# EasyEDA Pro project ProPrj_OpenTCUV4_2026-04-02.epro

# Schematic OpenTCUSandwich
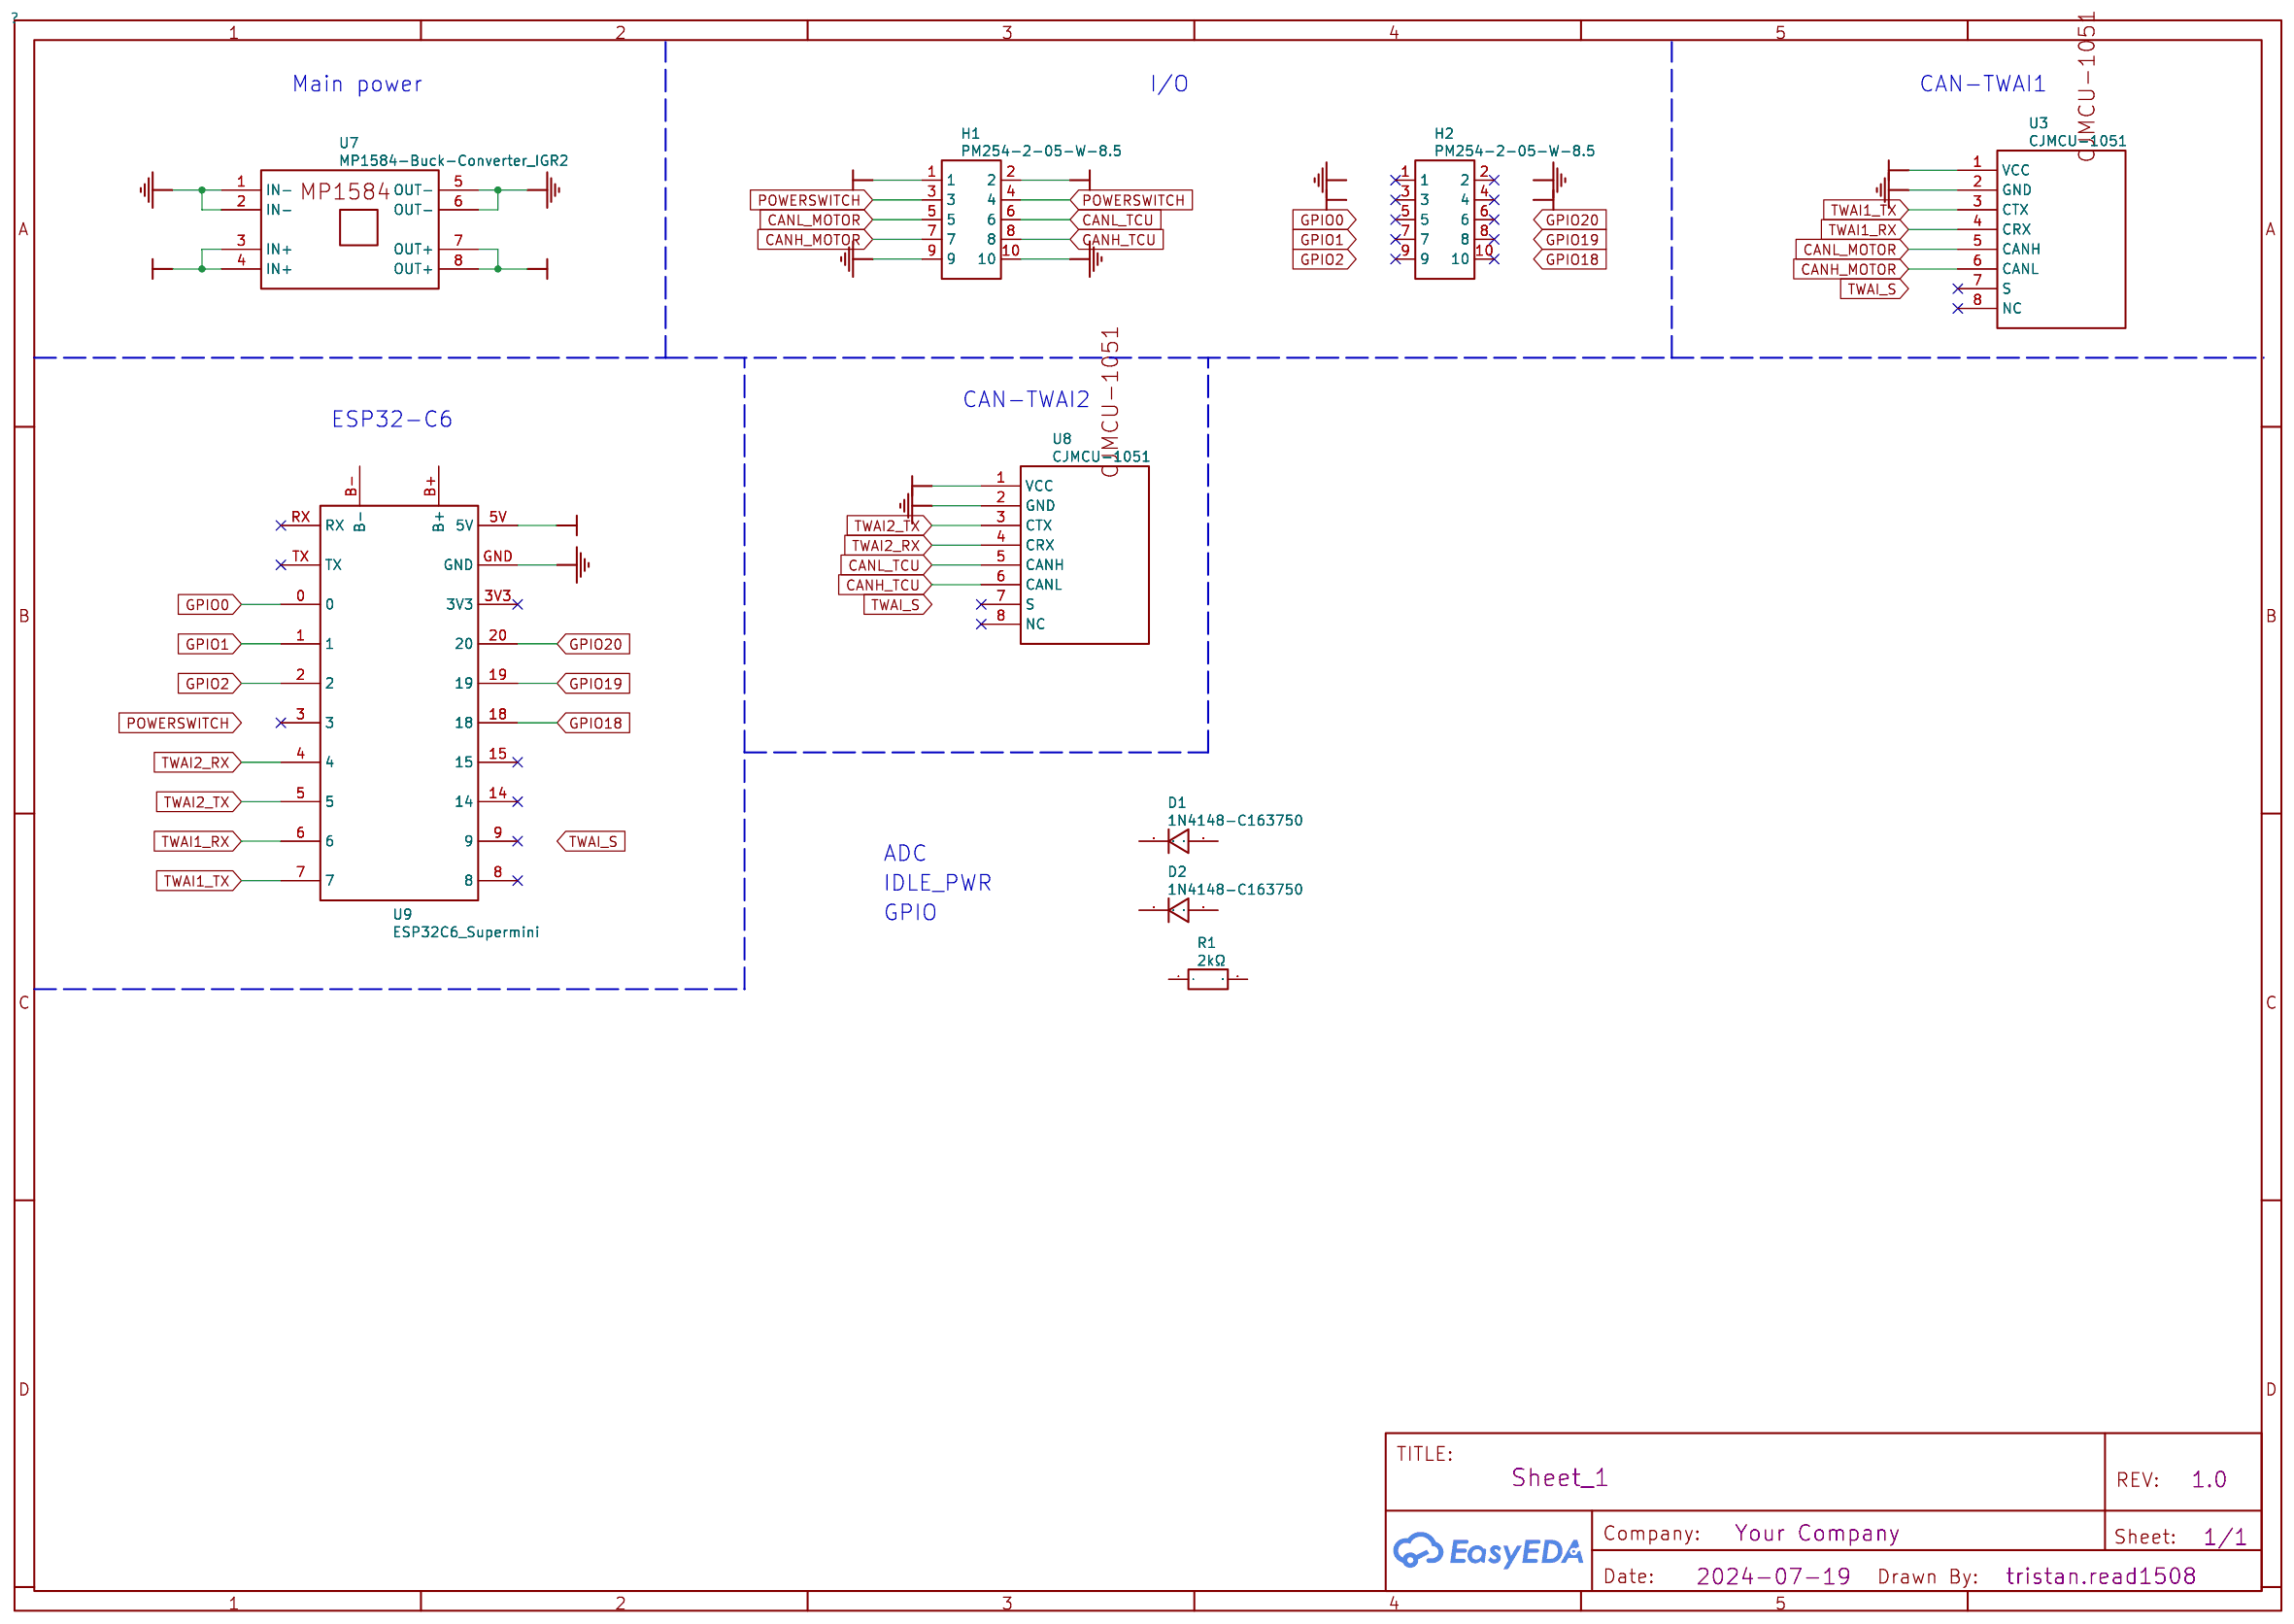
[diagram p0: schematic sheet]

## Parts
D1  1N4148-C163750  [DO-35_BD2.0-L4.2-P8.20-D0.5-RD]
D2  1N4148-C163750  [DO-35_BD2.0-L4.2-P8.20-D0.5-RD]
H1  PM254-2-05-W-8.5  [HDR-TH_10P-P2.54-H-F-R2-C5-W8.5]
H2  PM254-2-05-W-8.5  [HDR-TH_10P-P2.54-H-F-R2-C5-W8.5]
R1  2kΩ  [RES-TH_BD2.4-L6.3-P10.30-D0.6]
U3  CJMCU-1051  [CJMCU-1051]
U7  MP1584-Buck-Converter_IGR2  [MP1584EN-BUCK-CONVERTER]
U8  CJMCU-1051  [CJMCU-1051]
U9  ESP32C6_Supermini  [ESP32-C6-SUPERMINI]

## Library data of the parts
D1 D2 = 1N4148-C163750: Supplier Part: C163750; Supplier: LCSC; Manufacturer: FMS(美丽微); Manufacturer Part: 1N4148; JLCPCB Part Class: Extended Part; Contributor: LCSC; spicePre: D
H1 = PM254-2-05-W-8.5: Supplier: LCSC; Supplier Part: C2897425; Manufacturer: HCTL(华灿天禄); JLCPCB Part Class: Extended Part; Contributor: LCSC; spicePre: H
H2 = PM254-2-05-W-8.5: Supplier: LCSC; Supplier Part: C2897425; Manufacturer: HCTL(华灿天禄); JLCPCB Part Class: Extended Part; link: https://lcsc.com/eda_search?q=C2897425&%26type=1&ref=editor; Contributor: LCSC; spicePre: H
R1 = 2kΩ: Supplier: LCSC; Supplier Part: C410663; Manufacturer: Tyohm(幸亚电阻); Manufacturer Part: RN1/4W2KFT/BA1; JLCPCB Part Class: Extended Part; nameAlias: Value; Contributor: LCSC; spicePre: R; spiceSymbolName: RN 1/4W 2K F T/B A1
U3 U8 = CJMCU-1051: Contributor: ratedspg10; spicePre: U
U7 = MP1584-Buck-Converter_IGR2: Manufacturer Part: MP1584EN; Contributor: fazli wadood; spicePre: U
U9 = ESP32C6_Supermini: Contributor: Guest; spicePre: U

## Nets
+5V: U3.1(VCC) U7.7(OUT+) U7.8(OUT+) U8.1(VCC) U9.5V
GND: H1.9 H1.10 U3.2(GND) U7.1(IN-) U7.2(IN-) U7.5(OUT-) U7.6(OUT-) U8.2(GND) U9.GND
VCC: H1.1 H1.2 U7.3(IN+) U7.4(IN+)
CANH_MOTOR: H1.7 U3.6(CANL)
CANH_TCU: H1.8 U8.6(CANL)
CANL_MOTOR: H1.5 U3.5(CANH)
CANL_TCU: H1.6 U8.5(CANH)
GPIO0: U9.0
GPIO1: U9.1
GPIO2: U9.2
GPIO18: U9.18
GPIO19: U9.19
GPIO20: U9.20
POWERSWITCH: H1.3 H1.4
TWAI1_RX: U3.4(CRX) U9.6
TWAI1_TX: U3.3(CTX) U9.7
TWAI2_RX: U8.4(CRX) U9.4
TWAI2_TX: U8.3(CTX) U9.5

Not connected (* = marked no-connect by the designer): D1 1 2; D2 1 2; H2 1* 2* 3* 4* 5* 6* 7* 8* 9* 10*; R1 1 2; U3 7(S)* 8(NC)*; U8 7(S)* 8(NC)*; U9 3* 3V3* 8* 9* 14* 15* B+ B- RX* TX*

## Notes on the sheet
- Main power
- I/O
- CAN-TWAI1
- CAN-TWAI2
- ESP32-C6
- ADC
- IDLE_PWR
- GPIO

# Board PCB_OpenTCUSandwich
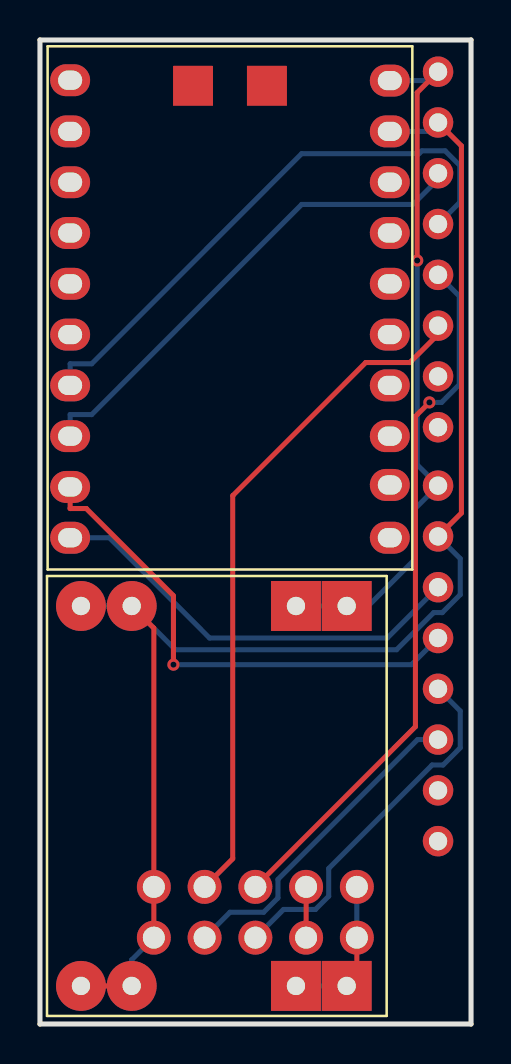
[diagram p1: board, top side]
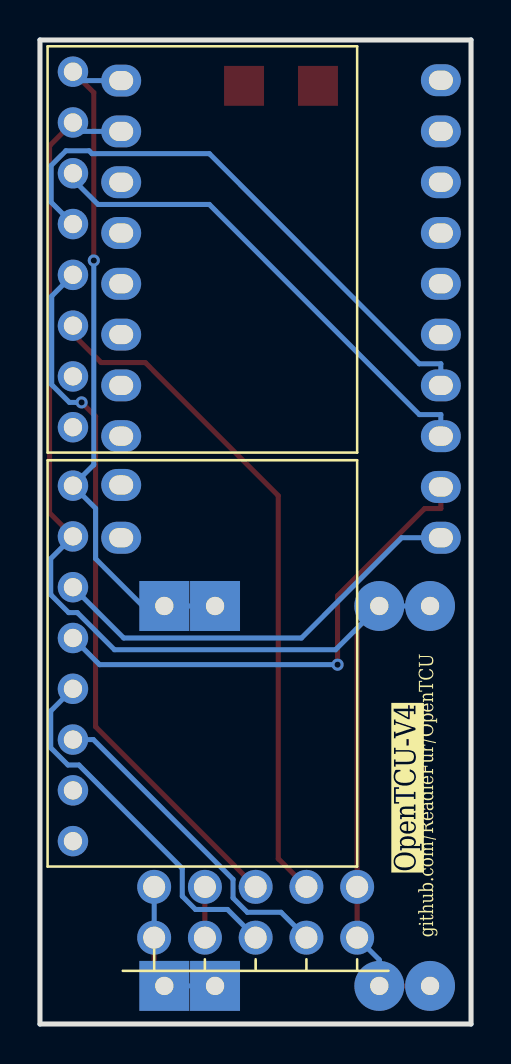
[diagram p2: board, bottom side, seen from below]

Outline 21.57 x 49.21 mm; copper layers: Top Layer, Bottom Layer. Coordinates in mm from the lower left corner of the outline.
Outline path: 0,49.21 21.57,49.21 21.57,0 0,0 0,49.21
Stack: Top Layer 0.035mm / Dielectric1 1.51mm FR4 er 4.5 / Bottom Layer 0.035mm

## Design rules (mm)
spacing Default (default): track to track 0.152, other pairs 0 to 0.152
track width Default (default): min 0.254, default 0.254, max 25.4
differential pair differentialPair (default): width min 0.127, default 0.254, max 2.54; gap min 0.152, default 0.152
via Default (default): diameter min 0.61, default 0.61, max 100.025; hole min 0.305, default 0.305, max 59.995

## Placement (name value [footprint] x y rotation side)
H1  PM254-2-05-W-8.5  [HDR-TH_10P-P2.54-H-F-R2-C5-W8.5]  10.78 5.59 180 bottom
U3  -  [CJMCU-1051]  19.92 14.22 180 bottom
U7  MP1584-Buck-Converter_IGR2  [MP1584EN-BUCK-CONVERTER]  15.35 1.91 90 top
U8  -  [CJMCU-1051]  19.92 34.93 180 bottom
U9  ESP32C6_Supermini  [ESP32-C6-SUPERMINI]  9.51 48.77 0 top

## Footprints (pads in the part's own frame, mm; a bottom-side part is the same pattern mirrored in y, then rotated)
CJMCU-1051
  round 1.524 hole 0.914: 1(0,12.7) 2(0,10.16) 3(0,7.62) 4(0,5.08) 5(0,2.54) 6(0,0) 7(0,-2.54) 8(0,-5.08)
ESP32-C6-SUPERMINI
  oval 2x1.6 hole 1.2x0.96: 0(-8,-6.67) 1(-8,-9.21) 2(-8,-11.75) 3(-8,-14.29) 3V3(8,-6.67) 4(-8,-16.83) 5(-8,-19.37) 5V(8,-1.59) 6(-8,-21.91) 7(-8,-24.45) 8(8,-24.45) 9(8,-21.81) 14(8,-19.37) 15(8,-16.83) 18(8,-14.29) 19(8,-11.75) 20(8,-9.21) GND(8,-4.13) RX(-8,-4.13) TX(-8,-1.57)
  rect 2x2 smd: B+(1.85,-1.85) B-(-1.85,-1.85)
HDR-TH_10P-P2.54-H-F-R2-C5-W8.5
  round 1.7 hole 1.1: 1(-5.08,-1.27) 2(-5.08,1.27) 3(-2.54,-1.27) 4(-2.54,1.27) 5(0,-1.27) 6(0,1.27) 7(2.54,-1.27) 8(2.54,1.27) 9(5.08,-1.27) 10(5.08,1.27)
MP1584EN-BUCK-CONVERTER
  round 2.5 hole 0.914: 1(0,13.3) 2(0,10.76) 5(19,13.3) 6(19,10.76)
  rect 2.5x2.5 hole 0.914: 3(0,2.54) 4(0,0) 7(19,2.54) 8(19,0)

## Nets
As in the schematic.

Pads without a net: U3 7 8; U8 7 8; U9 3 3V3 8 9 14 15 RX TX

## Via types
v1: diameter 0.61, hole 0.305, Top Layer to Bottom Layer, 3 vias

## Routing (per net, layer and track width the routed paths; a pad name or vN(x,y) marks a point on that pad's centre or on a via; arc(x,y) is an arc through that point)
+5V: length 35.2
  Top Layer w0.254: v1(18.88,38.18) 18.88,46.58 U8.1
  Bottom Layer w0.254: U9.5V 19.48,47.18 U8.1 ; U7.7 U7.8 16.43,20.91 18.79,23.27 18.79,25.79 U3.1 18.88,27.97 v1(18.88,38.18)
GND: length 71.1
  Top Layer w0.254: U7.6 5.7,19.8 H1.10 H1.9 ; U7.2 U7.1 ; U3.2 21.09,25.55 21.09,43.92 U8.2
  Bottom Layer w0.254: U3.2 21.03,23.27 21.03,21.47 20.14,20.57 19.71,20.57 17.85,18.72 6.78,18.72 U7.6 U7.5 ; U7.2 4.59,3.21 H1.9 ; U8.2 19.48,44.64 U9.GND
VCC: length 7.7
  Top Layer w0.254: U7.4 15.86,2.41 H1.1
  Bottom Layer w0.254: U7.3 U7.4 ; H1.2 H1.1
CANH_MOTOR: length 16.3
  Bottom Layer w0.254: U3.6 18.9,14.22 11.91,7.23 11.91,6.3 11.2,5.59 9.51,5.59 H1.7
CANH_TCU: length 34.2
  Top Layer w0.254: H1.8 9.65,8.27 9.65,26.43 16.3,33.08 18.51,33.08 19.92,34.49 U8.6
CANL_MOTOR: length 18.4
  Bottom Layer w0.254: H1.5 12.19,5.73 13.79,5.73 14.45,6.39 14.45,7.78 19.63,12.95 20.17,12.95 21.03,13.81 21.03,15.65 U3.5
CANL_TCU: length 35.6
  Top Layer w0.254: H1.6 18.79,14.87 18.79,30.39 v1(19.49,31.09)
  Bottom Layer w0.254: v1(19.49,31.09) 20.1,31.09 20.99,31.97 20.99,36.4 U8.5
POWERSWITCH: length 2.5
  Top Layer w0.254: H1.4 H1.3
TWAI1_RX: length 25.3
  Top Layer w0.254: v1(6.68,17.97) 6.68,21.42 2.32,25.78 1.51,25.78 U9.6
  Bottom Layer w0.254: U3.4 18.59,17.97 v1(6.68,17.97)
TWAI1_TX: length 21.5
  Bottom Layer w0.254: U3.3 17.38,19.3 8.49,19.3 3.47,24.32 U9.7
TWAI2_RX: length 28.7
  Bottom Layer w0.254: U8.4 21.02,41.1 21.02,42.93 20.28,43.67 19.12,43.67 18.97,43.53 13.1,43.53 2.59,33.02 1.51,33.02 U9.4
TWAI2_TX: length 24.7
  Bottom Layer w0.254: U9.5 1.51,30.48 2.59,30.48 13.1,40.99 18.67,40.99 19.92,42.24 U8.3

## Text on the board
Bottom Silkscreen Layer: github.com/ReadieFur/OpenTCU | OpenTCU-V4
